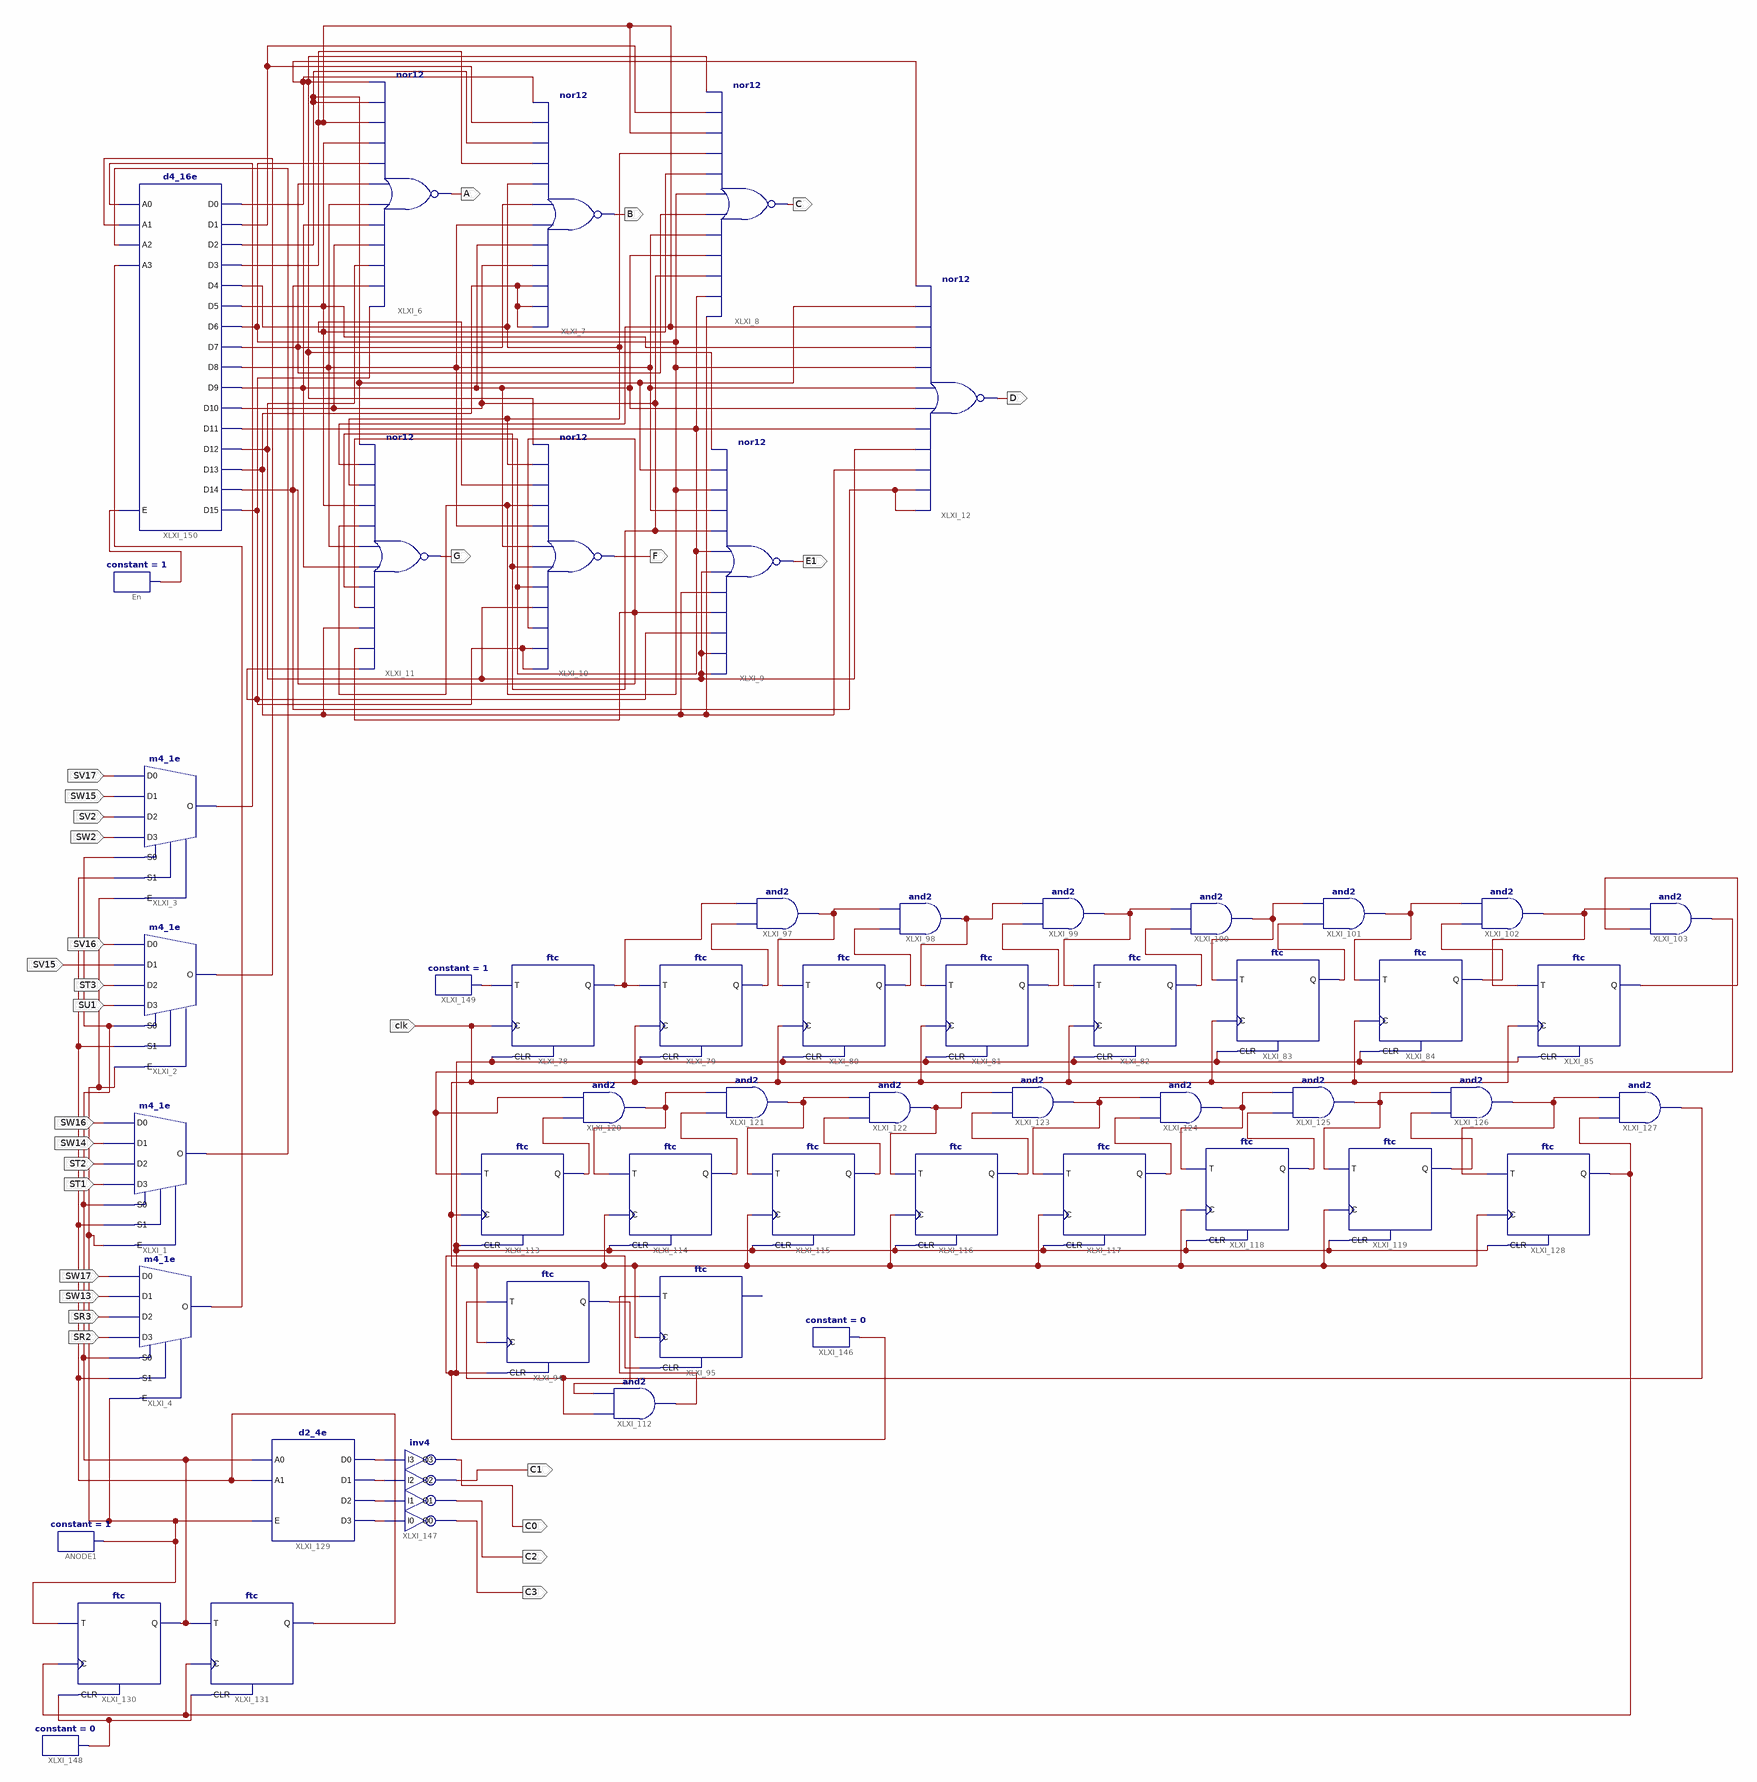
[diagram p0: schematic sheet 1]
// Xilinx ISE schematic ASS4COMP.sch (spartan6) as structural Verilog: 55 symbols, 28 ports
module ASS4COMP (
  input  clk,
  input  SV17,
  input  SW15,
  input  SV2,
  input  SW2,
  input  SV16,
  input  SV15,
  input  ST3,
  input  SU1,
  input  SW16,
  input  SW14,
  input  ST2,
  input  ST1,
  input  SW17,
  input  SW13,
  input  SR3,
  input  SR2,
  output E1,
  output A,
  output B,
  output C,
  output F,
  output G,
  output D,
  output C0,
  output C2,
  output C3,
  output C1
);

  wire A0, A1, A2, A3, XLXN_8, XLXN_10, XLXN_12, XLXN_15, XLXN_17, XLXN_19, XLXN_21, XLXN_22, XLXN_23,
       XLXN_24, XLXN_26, XLXN_29, XLXN_32, XLXN_35, XLXN_37, XLXN_40, XLXN_41, XLXN_183, XLXN_184, XLXN_186,
       XLXN_187, XLXN_190, XLXN_191, XLXN_196, XLXN_197, XLXN_199, XLXN_200, XLXN_202, XLXN_203, XLXN_204,
       XLXN_206, XLXN_208, XLXN_211, XLXN_212, XLXN_214, XLXN_215, XLXN_218, XLXN_219, XLXN_222, XLXN_223,
       XLXN_226, XLXN_227, XLXN_229, XLXN_231, XLXN_232, XLXN_234, XLXN_236, XLXN_237, XLXN_238, XLXN_251,
       XLXN_271, XLXN_274, XLXN_281, XLXN_282, XLXN_283, XLXN_284, XLXN_291, XLXN_292, XLXN_293, XLXN_311;

  m4_1e XLXI_1 (.D0(SW16), .D1(SW14), .D2(ST2), .D3(ST1), .E(XLXN_292), .S0(XLXN_271), .S1(XLXN_274), .O(A2));
  m4_1e XLXI_2 (.D0(SV16), .D1(SV15), .D2(ST3), .D3(SU1), .E(XLXN_292), .S0(XLXN_271), .S1(XLXN_274), .O(A1));
  m4_1e XLXI_3 (.D0(SV17), .D1(SW15), .D2(SV2), .D3(SW2), .E(XLXN_292), .S0(XLXN_271), .S1(XLXN_274), .O(A0));
  m4_1e XLXI_4 (.D0(SW17), .D1(SW13), .D2(SR3), .D3(SR2), .E(XLXN_292), .S0(XLXN_271), .S1(XLXN_274), .O(A3));
  constant #(.CValue("1")) En (.O(XLXN_41));
  nor XLXI_6 (A, XLXN_40, XLXN_37, XLXN_32, XLXN_26, XLXN_24, XLXN_23, XLXN_22, XLXN_21, XLXN_19, XLXN_15, XLXN_12, XLXN_8);
  nor XLXI_7 (B, XLXN_35, XLXN_35, XLXN_35, XLXN_26, XLXN_24, XLXN_23, XLXN_22, XLXN_17, XLXN_15, XLXN_12, XLXN_10, XLXN_8);
  nor XLXI_8 (C, XLXN_35, XLXN_29, XLXN_26, XLXN_24, XLXN_23, XLXN_22, XLXN_21, XLXN_19, XLXN_17, XLXN_15, XLXN_10, XLXN_8);
  nor XLXI_9 (E1, XLXN_32, XLXN_32, XLXN_40, XLXN_37, XLXN_35, XLXN_32, XLXN_29, XLXN_26, XLXN_23, XLXN_21, XLXN_12, XLXN_8);
  nor XLXI_10 (F, XLXN_40, XLXN_40, XLXN_37, XLXN_32, XLXN_29, XLXN_26, XLXN_24, XLXN_23, XLXN_21, XLXN_19, XLXN_17, XLXN_8);
  nor XLXI_11 (G, XLXN_40, XLXN_37, XLXN_35, XLXN_29, XLXN_26, XLXN_24, XLXN_23, XLXN_21, XLXN_19, XLXN_17, XLXN_15, XLXN_12);
  nor XLXI_12 (D, XLXN_37, XLXN_37, XLXN_35, XLXN_32, XLXN_29, XLXN_24, XLXN_23, XLXN_21, XLXN_19, XLXN_15, XLXN_12, XLXN_8);
  ftc XLXI_78 (.C(clk), .CLR(XLXN_251), .T(XLXN_311), .Q(XLXN_183));
  ftc XLXI_79 (.C(clk), .CLR(XLXN_251), .T(XLXN_183), .Q(XLXN_184));
  ftc XLXI_80 (.C(clk), .CLR(XLXN_251), .T(XLXN_186), .Q(XLXN_187));
  ftc XLXI_81 (.C(clk), .CLR(XLXN_251), .T(XLXN_190), .Q(XLXN_191));
  ftc XLXI_82 (.C(clk), .CLR(XLXN_251), .T(XLXN_196), .Q(XLXN_197));
  ftc XLXI_83 (.C(clk), .CLR(XLXN_251), .T(XLXN_199), .Q(XLXN_200));
  ftc XLXI_84 (.C(clk), .CLR(XLXN_251), .T(XLXN_202), .Q(XLXN_203));
  and XLXI_97 (XLXN_186, XLXN_184, XLXN_183);
  and XLXI_98 (XLXN_190, XLXN_187, XLXN_186);
  and XLXI_99 (XLXN_196, XLXN_191, XLXN_190);
  and XLXI_100 (XLXN_199, XLXN_197, XLXN_196);
  and XLXI_101 (XLXN_202, XLXN_200, XLXN_199);
  and XLXI_102 (XLXN_204, XLXN_203, XLXN_202);
  and XLXI_103 (XLXN_231, XLXN_206, XLXN_204);
  ftc XLXI_94 (.C(clk), .CLR(XLXN_251), .T(XLXN_237), .Q(XLXN_236));
  ftc XLXI_95 (.C(clk), .CLR(XLXN_251), .T(XLXN_238));  // open: Q
  and XLXI_112 (XLXN_238, XLXN_237, XLXN_236);
  ftc XLXI_85 (.C(clk), .CLR(XLXN_251), .T(XLXN_204), .Q(XLXN_206));
  ftc XLXI_113 (.C(clk), .CLR(XLXN_251), .T(XLXN_231), .Q(XLXN_232));
  ftc XLXI_114 (.C(clk), .CLR(XLXN_251), .T(XLXN_234), .Q(XLXN_208));
  ftc XLXI_115 (.C(clk), .CLR(XLXN_251), .T(XLXN_211), .Q(XLXN_212));
  ftc XLXI_116 (.C(clk), .CLR(XLXN_251), .T(XLXN_214), .Q(XLXN_215));
  ftc XLXI_117 (.C(clk), .CLR(XLXN_251), .T(XLXN_218), .Q(XLXN_219));
  ftc XLXI_118 (.C(clk), .CLR(XLXN_251), .T(XLXN_222), .Q(XLXN_223));
  ftc XLXI_119 (.C(clk), .CLR(XLXN_251), .T(XLXN_226), .Q(XLXN_227));
  and XLXI_120 (XLXN_234, XLXN_232, XLXN_231);
  and XLXI_121 (XLXN_211, XLXN_208, XLXN_234);
  and XLXI_122 (XLXN_214, XLXN_212, XLXN_211);
  and XLXI_123 (XLXN_218, XLXN_215, XLXN_214);
  and XLXI_124 (XLXN_222, XLXN_219, XLXN_218);
  and XLXI_125 (XLXN_226, XLXN_223, XLXN_222);
  and XLXI_126 (XLXN_229, XLXN_227, XLXN_226);
  and XLXI_127 (XLXN_237, XLXN_291, XLXN_229);
  ftc XLXI_128 (.C(clk), .CLR(XLXN_251), .T(XLXN_229), .Q(XLXN_291));
  d2_4e XLXI_129 (
    .A0(XLXN_271), .A1(XLXN_274), .E(XLXN_292), .D0(XLXN_284), .D1(XLXN_283), .D2(XLXN_282), .D3(XLXN_281));
  ftc XLXI_130 (.C(XLXN_291), .CLR(XLXN_293), .T(XLXN_292), .Q(XLXN_271));
  ftc XLXI_131 (.C(XLXN_291), .CLR(XLXN_293), .T(XLXN_271), .Q(XLXN_274));
  constant #(.CValue("1")) ANODE1 (.O(XLXN_292));
  constant #(.CValue("0")) XLXI_146 (.O(XLXN_251));
  inv4 XLXI_147 (.I0(XLXN_281), .I1(XLXN_282), .I2(XLXN_283), .I3(XLXN_284), .O0(C3), .O1(C2), .O2(C1), .O3(C0));
  constant #(.CValue("0")) XLXI_148 (.O(XLXN_293));
  constant #(.CValue("1")) XLXI_149 (.O(XLXN_311));
  d4_16e XLXI_150 (
    .A0(A0), .A1(A1), .A2(A2), .A3(A3), .E(XLXN_41), .D0(XLXN_8), .D1(XLXN_10), .D10(XLXN_26), .D11(XLXN_29),
    .D12(XLXN_32), .D13(XLXN_35), .D14(XLXN_37), .D15(XLXN_40), .D2(XLXN_12), .D3(XLXN_15), .D4(XLXN_17),
    .D5(XLXN_19), .D6(XLXN_21), .D7(XLXN_22), .D8(XLXN_23), .D9(XLXN_24));
endmodule
